# EAGLE schematic gesture_control_robot_rx (EAGLE 6.1)
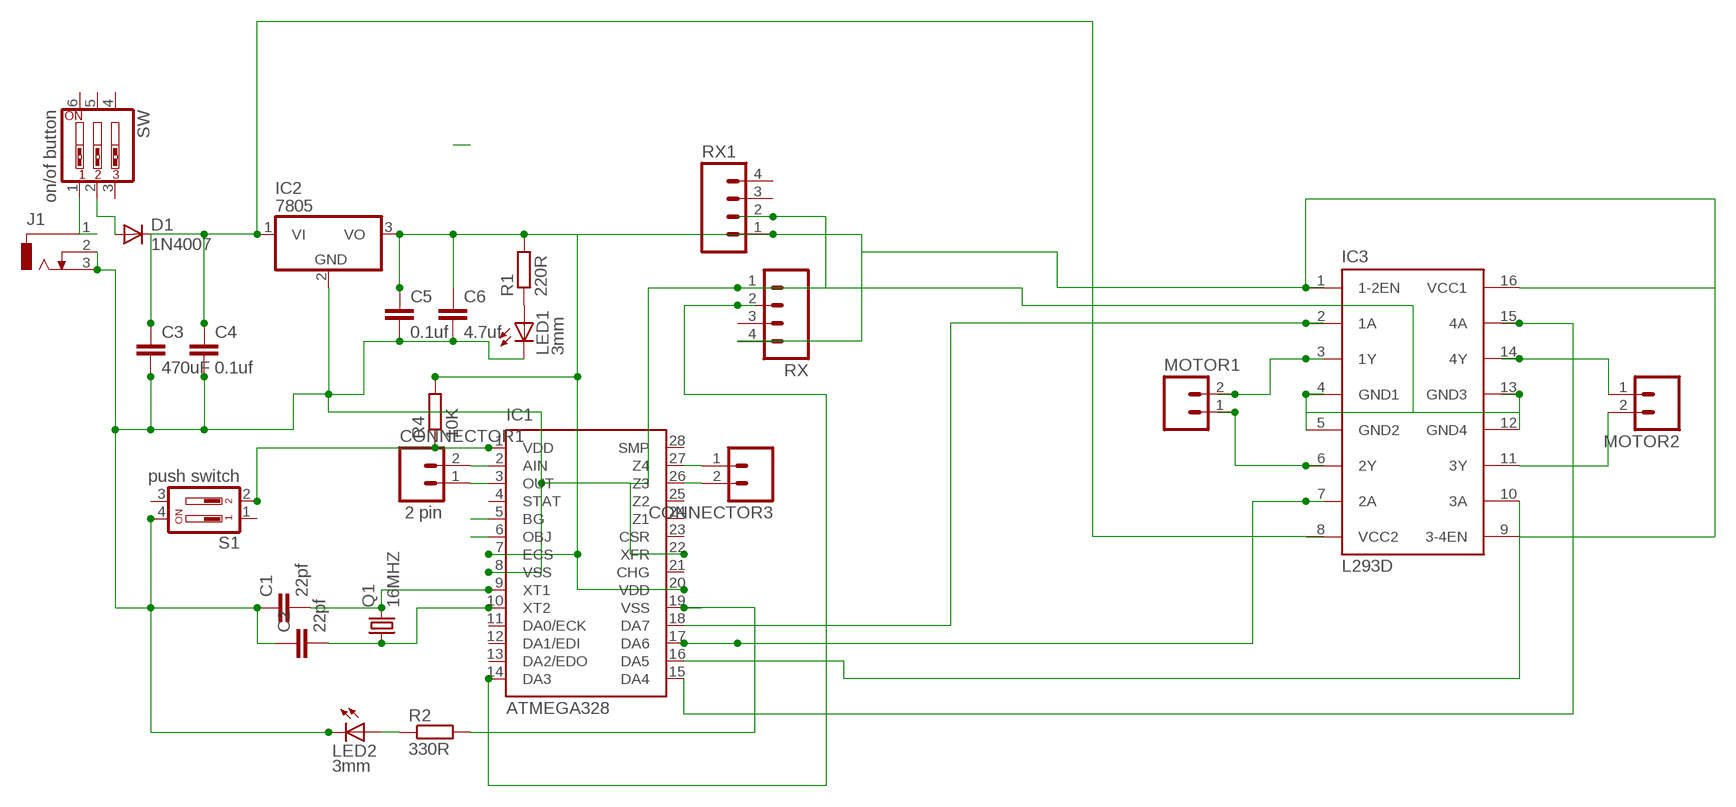
[diagram p0: schematic, sheet 1]

## Parts
C1  22pf  C2.5/2  [C2.5-2]
C2  22pf  C2.5/2  [C2.5-2]
C3  470uF  C2.5/2  [C2.5-2]
C4  0.1uf  C2.5/2  [C2.5-2]
C5  0.1uf  C2.5/2  [C2.5-2]
C6  4.7uf  C2.5/2  [C2.5-2]
CONNECTOR1  2 pin  M02  [02P]
CONNECTOR3  M02  [02P]
D1  1N4007  1N4004  [DO41-10]
IC1  ATMEGA328  QT9701BD  [DIL28-3]
IC2  7805  786TV  [TO220V]
IC3  L293D  [DIL16]
J1  DCJ0303  [DCJ0303]
LED1  3mm  LED3MM  [LED3MM]
LED2  3mm  LED3MM  [LED3MM]
MOTOR1  M02  [02P]
MOTOR2  M02  [02P]
Q1  16MHZ  CRYSTALHC49S  [HC49/S]
R1  220R  R-EU_0207/10  [0207/10]
R2  330R  R-EU_0207/10  [0207/10]
R4  10K  R-EU_0207/10  [0207/10]
RX  M04  [04P]
RX1  M04  [04P]
S1  push switch  DP02  [DP-02]
SW  on/of button  SW_DIP-3  [EDG-03]

## Nets
N$1: C1.2 IC1.9(XT1) Q1.2
N$2: C2.2 IC1.10(XT2) Q1.1
N$3: J1.1 SW.1
N$4: C3.1 C4.1 D1.C IC2.1(VI) IC3.8(VCC2)
N$5: C1.1 C2.1 C3.2 C4.2 C5.2 C6.2 IC1.8(VSS) IC1.22(XFR) IC2.2(GND) IC3.4(GND1) IC3.5(GND2) IC3.12(GND4) IC3.13(GND3) J1.2 J1.3 LED1.K(C) LED2.K(C) RX1.2 RX.1 S1.4
N$6: LED1.A R1.1
N$7: IC1.17(DA6) IC3.7(2A)
N$8: CONNECTOR1.1 IC1.3(OUT)
N$9: CONNECTOR1.2 IC1.2(AIN)
N$10: IC1.6(OBJ)
N$11: IC1.5(BG)
N$12: CONNECTOR3.1 IC1.27(Z4)
N$13: CONNECTOR3.2 IC1.26(Z3)
N$14: IC1.14(DA3) RX.2
N$15: IC1.18(DA7) IC3.2(1A)
N$16: IC1.15(DA4) IC3.15(4A)
N$17: D1.A SW.2
N$21: IC1.16(DA5) IC3.10(3A)
N$25: IC3.14(4Y) MOTOR2.1
N$27: IC1.19(VSS) R2.2
N$28: IC3.11(3Y) MOTOR2.2
N$31: IC1.1(VDD) R4.1 S1.2
N$32: LED2.A R2.1
N$33: C5.1 C6.1 IC1.7(ECS) IC1.20(VDD) IC2.3(VO) IC3.1(1-2EN) IC3.9(3-4EN) IC3.16(VCC1) R1.2 R4.2 RX1.1 RX.4
N$34: IC3.6(2Y) MOTOR1.1
N$35: IC3.3(1Y) MOTOR1.2
Unconnected: IC1.4(STAT) IC1.11(DA0/ECK) IC1.12(DA1/EDI) IC1.13(DA2/EDO) IC1.21(CHG) IC1.23(CSR) IC1.24(Z1) IC1.25(Z2) IC1.28(SMP) RX1.3 RX1.4 RX.3 S1.1 S1.3 SW.3 SW.4 SW.5 SW.6

## Library data of the parts
C1-C6 = capacitor-wima:C: CAPACITOR naming: grid - package width
CONNECTOR1 CONNECTOR3 MOTOR1 MOTOR2 = con-amp-quick:M02: AMP QUICK CONNECTOR; OC_FARNELL: unknown; OC_NEWARK: unknown
D1 = diode:1N4004: DIODE general purpose rectifier, 1 A
IC1 = quantum-research-group:QT9701B: Charge-Transfer Capacitance Sensor IC Source: http://data.qprox.com/downloads/datasheets/qt9701b.pdf; OC_FARNELL: unknown; OC_NEWARK: unknown
IC2 = linear:78*: Positive VOLTAGE REGULATOR Source: http://cache.national.com/ds/LM/LM78L05.pdf http://www.fairchildsemi.com/ds/LM/LM7805.pdf
IC3 = st-microelectronics:L293D: PUSH-PULL 4 CHANNEL DRIVER; MPN: L293D; OC_FARNELL: 9589619; OC_NEWARK: 56P8249
J1 = con-jack:DCJ0303: DC POWER JACK Source: DCJ0303.pdf; OC_FARNELL: unknown; OC_NEWARK: unknown
LED1 LED2 = led:LED: LED OSRAM: - CHIPLED LG R971, LG N971, LY N971, LG Q971, LY Q971, LO R971, LY R971 LH N974, LH R974 LS Q976, LO Q976, LY Q976 LO Q996 - Hyper CHIPLED LW Q18S LB Q993, LB Q99A, LB R99A - SideLED LS A670, LO A670, LY A670, LG A670, LP A670 LB A673, LV A673, LT A673, LW A673 LH A674 LY A675 LS A676, LA A676, LO A676, LY A676, LW A676 LS A679, LY A679, LG A679 - Hyper Micro SIDELED® LS Y876, LA Y876, LO Y876, LY Y876 LT Y87S - SmartLED LW L88C, LW L88S LB L89C, LB L89S, LG L890 LS L89K, LO L89K, LY L89K LS L896, LA L896, LO L896, LY L896 - TOPLED LS T670, LO T670, LY T670, LG T670, LP T670 LSG T670, LSP T670, LSY T670, LOP T670, LYG T670 LG T671, LOG T671, LSG T671 LB T673, LV T673, LT T673, LW T673 LH T674 LS T676, LA T676, LO T676, LY T676, LB T676, LH T676, LSB T676, LW T676 LB T67C, LV T67C, LT T67C, LS T67K, LO T67K, LY T67K, LW E67C LS E67B, LA E67B, LO E67B, LY E67B, LB E67C, LV E67C, LT E67C LW T67C LS T679, LY T679, LG T679 LS T770, LO T770, LY T770, LG T770, LP T770 LB T773, LV T773, LT T773, LW T773 LH T774 LS E675, LA E675, LY E675, LS T675 LS T776, LA T776, LO T776, LY T776, LB T776 LHGB T686 LT T68C, LB T68C - Hyper Mini TOPLED® LB M676 - Mini TOPLED Santana® LG M470 LS M47K, LO M47K, LY M47K Source: http://www.osram.convergy.de LUXEON: - LUMILED® LXK2-PW12-R00, LXK2-PW12-S00, LXK2-PW14-U00, LXK2-PW14-V00 LXK2-PM12-R00, LXK2-PM12-S00, LXK2-PM14-U00 LXK2-PE12-Q00, LXK2-PE12-R00, LXK2-PE12-S00, LXK2-PE14-T00, LXK2-PE14-U00 LXK2-PB12-K00, LXK2-PB12-L00, LXK2-PB12-M00, LXK2-PB14-N00, LXK2-PB14-P00, LXK2-PB14-Q00 LXK2-PR12-L00, LXK2-PR12-M00, LXK2-PR14-Q00, LXK2-PR14-R00 LXK2-PD12-Q00, LXK2-PD12-R00, LXK2-PD12-S00 LXK2-PH12-R00, LXK2-PH12-S00 LXK2-PL12-P00, LXK2-PL12-Q00, LXK2-PL12-R00 Source: www.luxeon.com KINGBRIGHT: KA-3528ASYC Source: www.kingbright.com
Q1 = crystal:CRYSTAL: CRYSTAL; OC_FARNELL: 1667008; OC_NEWARK: unknown
R1 R2 R4 = rcl:R-EU_: RESISTOR, European symbol
RX RX1 = con-amp-quick:M04: AMP QUICK CONNECTOR; OC_FARNELL: unknown; OC_NEWARK: unknown
S1 = switch-dil:DP02: DIL/CODE SWITCH; MPN: MCDP02; OC_FARNELL: 1255233; OC_NEWARK: 26M1095
SW = special:SW_DIP-3: DIP SWITCH